# EAGLE design board (EAGLE 6.4)
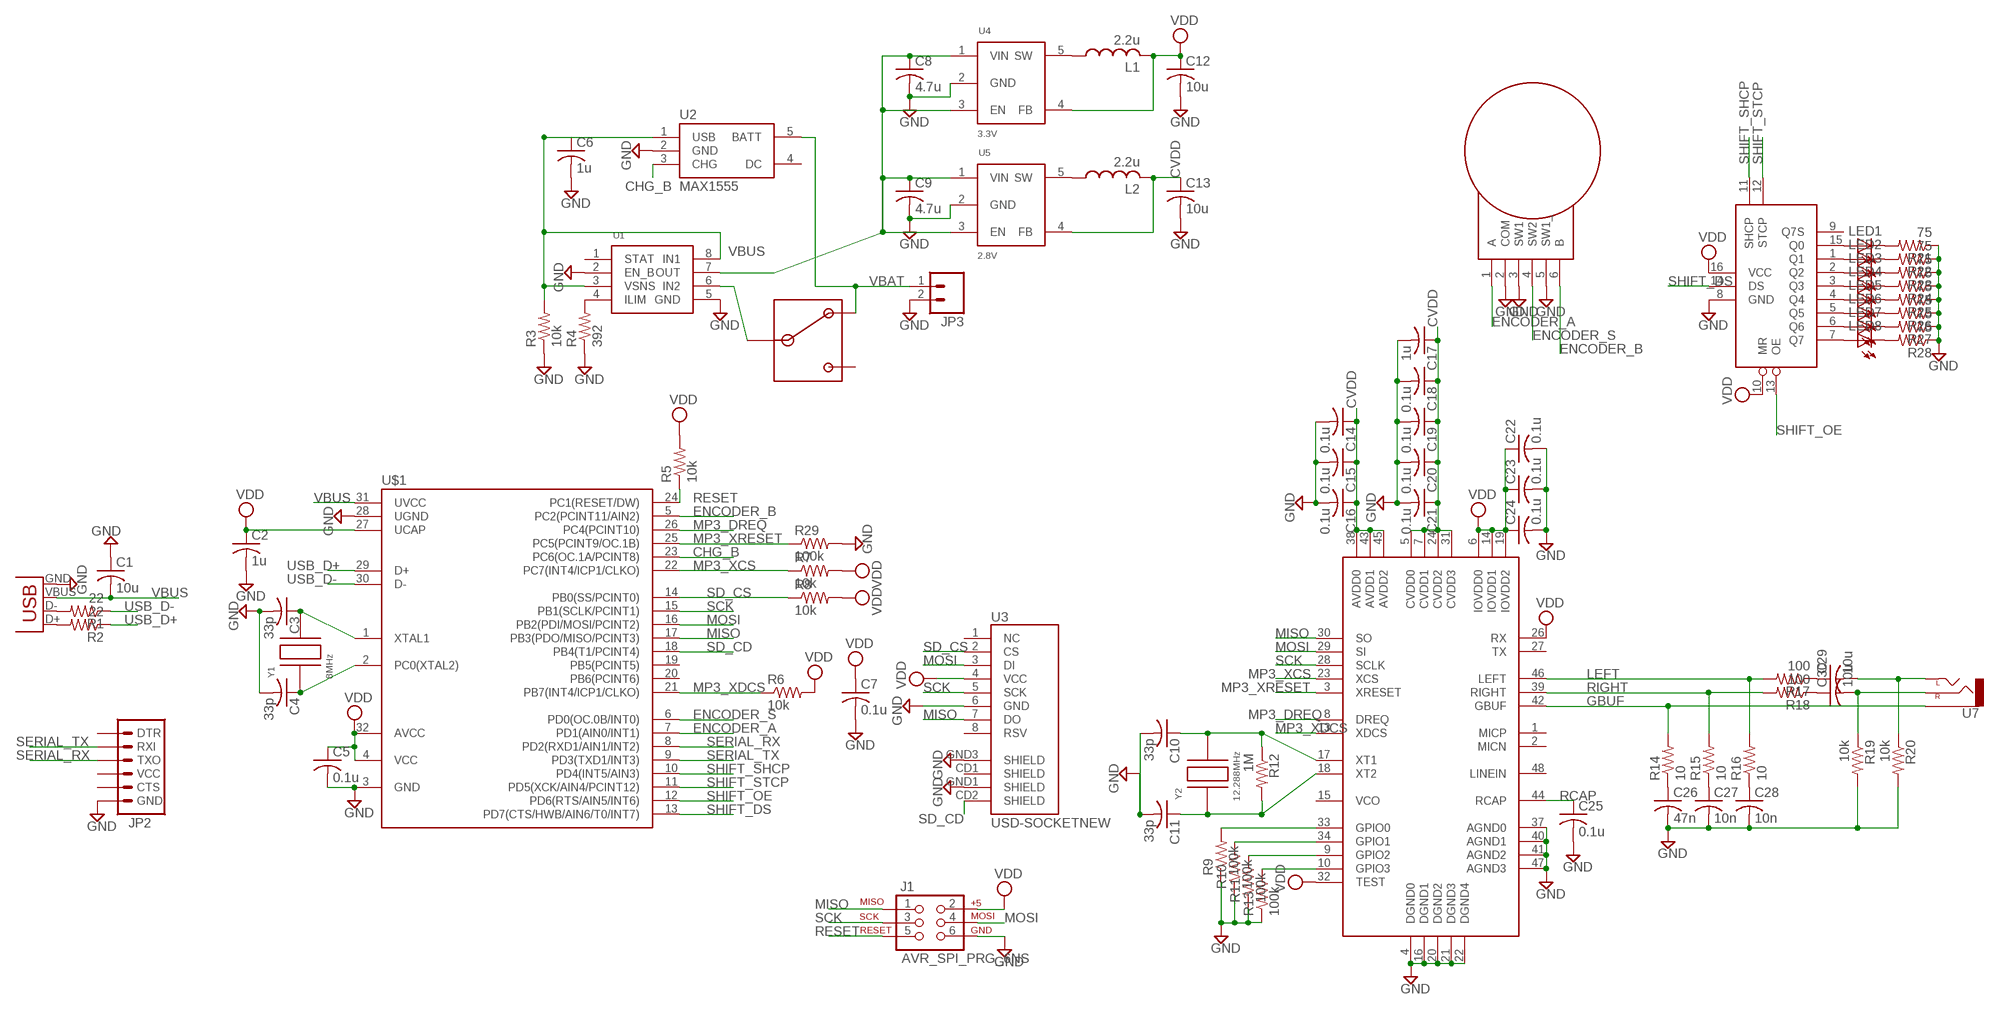
[diagram p0: schematic, sheet 1]

## Parts
C1  10u  C-USC0603K  [C0603K]
C2  1u  C-USC0603K  [C0603K]
C3  33p  C-USC0603K  [C0603K]
C4  33p  C-USC0603K  [C0603K]
C5  0.1u  C-USC0603K  [C0603K]
C6  1u  C-USC0603K  [C0603K]
C7  0.1u  C-USC0603K  [C0603K]
C8  4.7u  C-USC0603K  [C0603K]
C9  4.7u  C-USC0603K  [C0603K]
C10  33p  C-USC0603K  [C0603K]
C11  33p  C-USC0603K  [C0603K]
C12  10u  C-USC0603K  [C0603K]
C13  10u  C-USC0603K  [C0603K]
C14  0.1u  C-USC0603K  [C0603K]
C15  0.1u  C-USC0603K  [C0603K]
C16  0.1u  C-USC0603K  [C0603K]
C17  1u  C-USC0603K  [C0603K]
C18  0.1u  C-USC0603K  [C0603K]
C19  0.1u  C-USC0603K  [C0603K]
C20  0.1u  C-USC0603K  [C0603K]
C21  0.1u  C-USC0603K  [C0603K]
C22  0.1u  C-USC0603K  [C0603K]
C23  0.1u  C-USC0603K  [C0603K]
C24  0.1u  C-USC0603K  [C0603K]
C25  0.1u  C-USC0603K  [C0603K]
C26  47n  C-USC0603K  [C0603K]
C27  10n  C-USC0603K  [C0603K]
C28  10n  C-USC0603K  [C0603K]
C29  10u  C-USC0603K  [C0603K]
C30  10u  C-USC0603K  [C0603K]
J1  AVR_SPI_PRG_6NS  [2X3-NS]
JP1  USBSMD  [USB-MINIB]
JP2  ARDUINO_SERIAL_PROGRAMLOCK  [1X06_LOCK]
JP3  M02PTH  [1X02]
L1  2.2u  IHLP-2020CZ-11  [IHLP-2020CZ-11]
L2  2.2u  IHLP-2020CZ-11  [IHLP-2020CZ-11]
LED1  LED1206  [LED-1206]
LED2  LED1206  [LED-1206]
LED3  LED1206  [LED-1206]
LED4  LED1206  [LED-1206]
LED5  LED1206  [LED-1206]
LED6  LED1206  [LED-1206]
LED7  LED1206  [LED-1206]
LED8  LED1206  [LED-1206]
R1  22  R-US_R0603W  [R0603W]
R2  22  R-US_R0603W  [R0603W]
R3  10k  R-US_R0603  [R0603]
R4  392  R-US_R0603  [R0603]
R5  10k  R-US_R0603  [R0603]
R6  10k  R-US_R0603W  [R0603W]
R7  10k  R-US_R0603W  [R0603W]
R8  10k  R-US_R0603W  [R0603W]
R9  100k  R-US_R0603W  [R0603W]
R10  100k  R-US_R0603W  [R0603W]
R11  100k  R-US_R0603W  [R0603W]
R12  1M  R-US_R0603  [R0603]
R13  100k  R-US_R0603W  [R0603W]
R14  10  R-US_R0603W  [R0603W]
R15  10  R-US_R0603W  [R0603W]
R16  10  R-US_R0603W  [R0603W]
R17  100  R-US_R0603W  [R0603W]
R18  100  R-US_R0603W  [R0603W]
R19  10k  R-US_R0603W  [R0603W]
R20  10k  R-US_R0603W  [R0603W]
R21  75  R-US_R0603W  [R0603W]
R22  75  R-US_R0603W  [R0603W]
R23  75  R-US_R0603W  [R0603W]
R24  75  R-US_R0603W  [R0603W]
R25  75  R-US_R0603W  [R0603W]
R26  75  R-US_R0603W  [R0603W]
R27  75  R-US_R0603W  [R0603W]
R28  75  R-US_R0603W  [R0603W]
R29  100k  R-US_R0603W  [R0603W]
S1  JS102011SAQN  [JS102011SAQN]
S2  EVQ-WKA  [EVQ-WKA]
U1  TPS2112A  [TSSOP8]
U2  MAX1555  [SOT23-5]
U3  USD-SOCKETNEW  [MICRO-SD-SOCKET-PP]
U4  3.3V  LM3671  [SOT23-5]
U5  2.8V  LM3671  [SOT23-5]
U6  74HC595  [TSSOP16]
U7  AUDIO-JACKSMD2  [AUDIO-JACK-3.5MM-SMD]
U$1  ATMEGA32U2  [TQFP32-08]
U$2  VS1003  [LQFP-48]
Y1  8MHz  CSM-7X  [HC49/US]
Y2  12.288MHz  CSM-3X  [CSM-3X]

## Nets
CHG_B: U2.3(CHG) U$1.23(PC6(OC.1A/PCINT8))
CVDD: C13.1 C14.1 C15.1 C16.1 C17.1 C18.1 C19.1 C20.1 C21.1 L2.P$2 U5.4(FB) U$2.5(CVDD0) U$2.7(CVDD1) U$2.24(CVDD2) U$2.31(CVDD3) U$2.38(AVDD0) U$2.43(AVDD1) U$2.45(AVDD2)
ENCODER_A: S2.1(A) U$1.7(PD1(AIN0/INT1))
ENCODER_B: S2.6(B) U$1.5(PC2(PCINT11/AIN2))
ENCODER_S: S2.4(SW2) U$1.6(PD0(OC.0B/INT0))
GBUF: R14.2 U7.SLEEVE U$2.42(GBUF)
GND: C1.1 C2.2 C3.2 C4.2 C5.2 C6.2 C7.2 C8.2 C9.2 C10.2 C11.2 C12.2 C13.2 C14.2 C15.2 C16.2 C17.2 C18.2 C19.2 C20.2 C21.2 C22.2 C23.2 C24.2 C25.2 C26.2 C27.2 C28.2 J1.6 JP1.GND JP2.6(GND) JP3.2 R3.1 R4.1 R9.1 R10.1 R11.1 R13.1 R19.2 R20.2 R21.1 R22.1 R23.1 R24.1 R25.1 R26.1 R27.1 R28.1 R29.2 S2.2(COM) S2.3(SW1) S2.5(SW1_) U1.2(EN_B) U1.5(GND) U2.2(GND) U3.6(GND) U3.GND1(SHIELD) U3.GND3(SHIELD) U4.2(GND) U5.2(GND) U6.8(GND) U$1.3(GND) U$1.28(UGND) U$2.4(DGND0) U$2.16(DGND1) U$2.20(DGND2) U$2.21(DGND3) U$2.22(DGND4) U$2.37(AGND0) U$2.40(AGND1) U$2.41(AGND2) U$2.47(AGND3)
GPIO0: R9.2 U$2.33(GPIO0)
GPIO1: R10.2 U$2.34(GPIO1)
GPIO2: R11.2 U$2.9(GPIO2)
GPIO3: R13.2 U$2.10(GPIO3)
LEFT: R16.2 R17.2 U$2.46(LEFT)
MISO: J1.1 U3.7(DO) U$1.17(PB3(PDO/MISO/PCINT3)) U$2.30(SO)
MOSI: J1.4 U3.3(DI) U$1.16(PB2(PDI/MOSI/PCINT2)) U$2.29(SI)
MP3_DREQ: U$1.26(PC4(PCINT10)) U$2.8(DREQ)
MP3_XCS: R7.1 U$1.22(PC7(INT4/ICP1/CLKO)) U$2.23(XCS)
MP3_XDCS: R6.1 U$1.21(PB7(INT4/ICP1/CLKO)) U$2.13(XDCS)
MP3_XRESET: R29.1 U$1.25(PC5(PCINT9/OC.1B)) U$2.3(XRESET)
N$1: JP1.D- R1.2
N$2: C3.1 U$1.1(XTAL1) Y1.P$2
N$3: C26.1 R14.1
N$4: C27.1 R15.1
N$5: C28.1 R16.1
N$6: JP1.D+ R2.2
N$7: C11.1 R12.2 U$2.18(XT2) Y2.P$1
N$8: C10.1 R12.1 U$2.17(XT1) Y2.P$2
N$10: C30.1 R18.1
N$11: C29.1 R17.1
N$12: C30.2 R19.1 U7.RING(RIGHT)
N$13: C29.2 R20.1 U7.TIP(LEFT)
N$14: C4.1 U$1.2(PC0(XTAL2)) Y1.P$1
N$17: R4.2 U1.4(ILIM)
N$18: C8.1 C9.1 U1.7(OUT) U4.1(VIN) U4.3(EN) U5.1(VIN) U5.3(EN)
N$19: LED8.A U6.7(Q7)
N$20: LED7.A U6.6(Q6)
N$21: LED6.A U6.5(Q5)
N$22: LED5.A U6.4(Q4)
N$23: LED4.A U6.3(Q3)
N$24: LED3.A U6.2(Q2)
N$25: LED2.A U6.1(Q1)
N$26: LED1.A U6.15(Q0)
N$27: LED1.C R21.2
N$28: LED2.C R22.2
N$29: LED3.C R23.2
N$30: LED4.C R24.2
N$31: LED5.C R25.2
N$32: LED6.C R26.2
N$33: LED7.C R27.2
N$34: LED8.C R28.2
N$35: L1.P$1 U4.5(SW)
N$36: L2.P$1 U5.5(SW)
N$37: S1.P$2 U1.6(IN2)
RCAP: C25.1 U$2.44(RCAP)
RESET: J1.5 R5.1 U$1.24(PC1(RESET/DW))
RIGHT: R15.2 R18.2 U$2.39(RIGHT)
SCK: J1.3 U3.5(SCK) U$1.15(PB1(SCLK/PCINT1)) U$2.28(SCLK)
SD_CD: U3.CD2(SHIELD) U$1.18(PB4(T1/PCINT4))
SD_CS: R8.1 U3.2(CS) U$1.14(PB0(SS/PCINT0))
SERIAL_RX: JP2.3(TXO) U$1.8(PD2(RXD1/AIN1/INT2))
SERIAL_TX: JP2.2(RXI) U$1.9(PD3(TXD1/INT3))
SHIFT_DS: U6.14(DS) U$1.13(PD7(CTS/HWB/AIN6/T0/INT7))
SHIFT_OE: U6.13(OE) U$1.12(PD6(RTS/AIN5/INT6))
SHIFT_SHCP: U6.11(SHCP) U$1.10(PD4(INT5/AIN3))
SHIFT_STCP: U6.12(STCP) U$1.11(PD5(XCK/AIN4/PCINT12))
USB_D+: R2.1 U$1.29(D+)
USB_D-: R1.1 U$1.30(D-)
VBAT: JP3.1 S1.P$3 U2.5(BATT)
VBUS: C1.2 C6.1 JP1.VBUS R3.2 U1.3(VSNS) U1.8(IN1) U2.1(USB) U$1.31(UVCC)
VDD: C2.1 C5.1 C7.1 C12.1 C22.1 C23.1 C24.1 J1.2 L1.P$2 R5.2 R6.2 R7.2 R8.2 U3.4(VCC) U4.4(FB) U6.10(MR) U6.16(VCC) U$1.4(VCC) U$1.27(UCAP) U$1.32(AVCC) U$2.6(IOVDD0) U$2.14(IOVDD1) U$2.19(IOVDD2) U$2.26(RX) U$2.32(TEST)
Unconnected: JP2.1(DTR) JP2.4(VCC) JP2.5(CTS) S1.P$1 U1.1(STAT) U2.4(DC) U3.1(NC) U3.8(RSV) U3.CD1(SHIELD) U6.9(Q7S) U$1.19(PB5(PCINT5)) U$1.20(PB6(PCINT6)) U$2.1(MICP) U$2.2(MICN) U$2.15(VCO) U$2.27(TX) U$2.48(LINEIN)

## Library data of the parts
C1-C30 = rcl:C-US: CAPACITOR, American symbol
J1 = SparkFun-Connectors:AVR_SPI_PRG_6: AVR ISP 6 Pin This is the reduced ISP connector for AVR programming. Common on Arduino. This footprint will take up less PCB space and can be used with a 10-pin to 6-pin adapter such as SKU: BOB-08508
JP1 = SparkFun-Connectors:USB: USB Connectors USB-B-PTH is fully proven SKU : PRT-00139/CONN-08278 USB-miniB is fully proven SKU : PRT-00587 USB-A-PCB is untested. USB-A-H is throughly reviewed, but untested. Spark Fun Electronics SKU : PRT-00437 USB-B-SMT is throughly reviewed, but untested. Needs silkscreen touching up. USB-A-S has not been used/tested USB-MB-H has not been used/tested USB-MICROB has been used. CONN-09505
JP2 = SparkFun-Connectors:ARDUINO_SERIAL_PROGRAM: FTDI connector footprints
JP3 = SparkFun-Connectors:M02: Header 2 Standard 2-pin 0.1" header. Use with straight break away headers (SKU : PRT-00116), right angle break away headers (PRT-00553), swiss pins (PRT-00743), machine pins (PRT-00117), and female headers (PRT-00115). Molex polarized connector foot print use with SKU : PRT-08233 with associated crimp pins and housings.
L1 L2 = mkmp3:IHLP-2020CZ-11: IHLP-2020CZ-11 - SMT Inductor Digikey: 541-1236-1-ND
LED1-LED8 = LilyPad-Wearables:LED: LEDs Standard schematic elements and footprints for 5mm, 3mm, 1206, and 0603 sized LEDs. 5mm - Spark Fun Electronics SKU : Comp-SBL
R1-R29 = rcl:R-US_: RESISTOR, American symbol
S1 = mkmp3:JS102011SAQN: JS102011SAQN - SMT slide switch Digikey: 401-1999-1-ND
S2 = mkmp3:EVQ-WKA: EVQ-WKA - Rotary encoder & switch Digikey: P13381SCT-ND
U1 = mkmp3:TPS2112A: TPS2112A - Source selector switch Digikey: 296-34595-5-ND
U2 = SparkFun-PowerIC:MAX1555: MAX1555 Lithium Charger IC SOT-23 Lithium Polymer charging IC. Schematic element and footprint proven. Spark Fun Electronics SKU : COM-00674
U3 = SparkFun-Connectors:USD-SOCKET: microSD Socket Push-push type uSD socket. Schematic element and footprint production proven. Spark Fun Electronics SKU : PRT-00127. tDoc lines correctly indicate media card edge positions when inserting (unlocked, locked, depressed).
U4 U5 = mkmp3:LM3671: LM3671 - Buck regulator Texas Instruments Step-down (buck) power regulator
U6 = mkmp3:74HC595: 74HC595 - 8-bit shift register Digikey: 568-2263-1-ND
U7 = mkmp3:AUDIO-JACK: 3.5mm Audio Jack Simple 3.5mm common PCB mount audio jack. SKU: PRT-08032
U$1 = CEDT:ATMEGA32U2
U$2 = mkmp3:VS1003
Y1 = mkmp3:CSM-7X: CSM-7X - Quartz Crystal ECS International SMD version of the HC-49USX leaded crystal
Y2 = mkmp3:CSM-3X: CMS-3X - Quartz Crystal ECS International Miniature low profile SMD quartz crystal

## Board
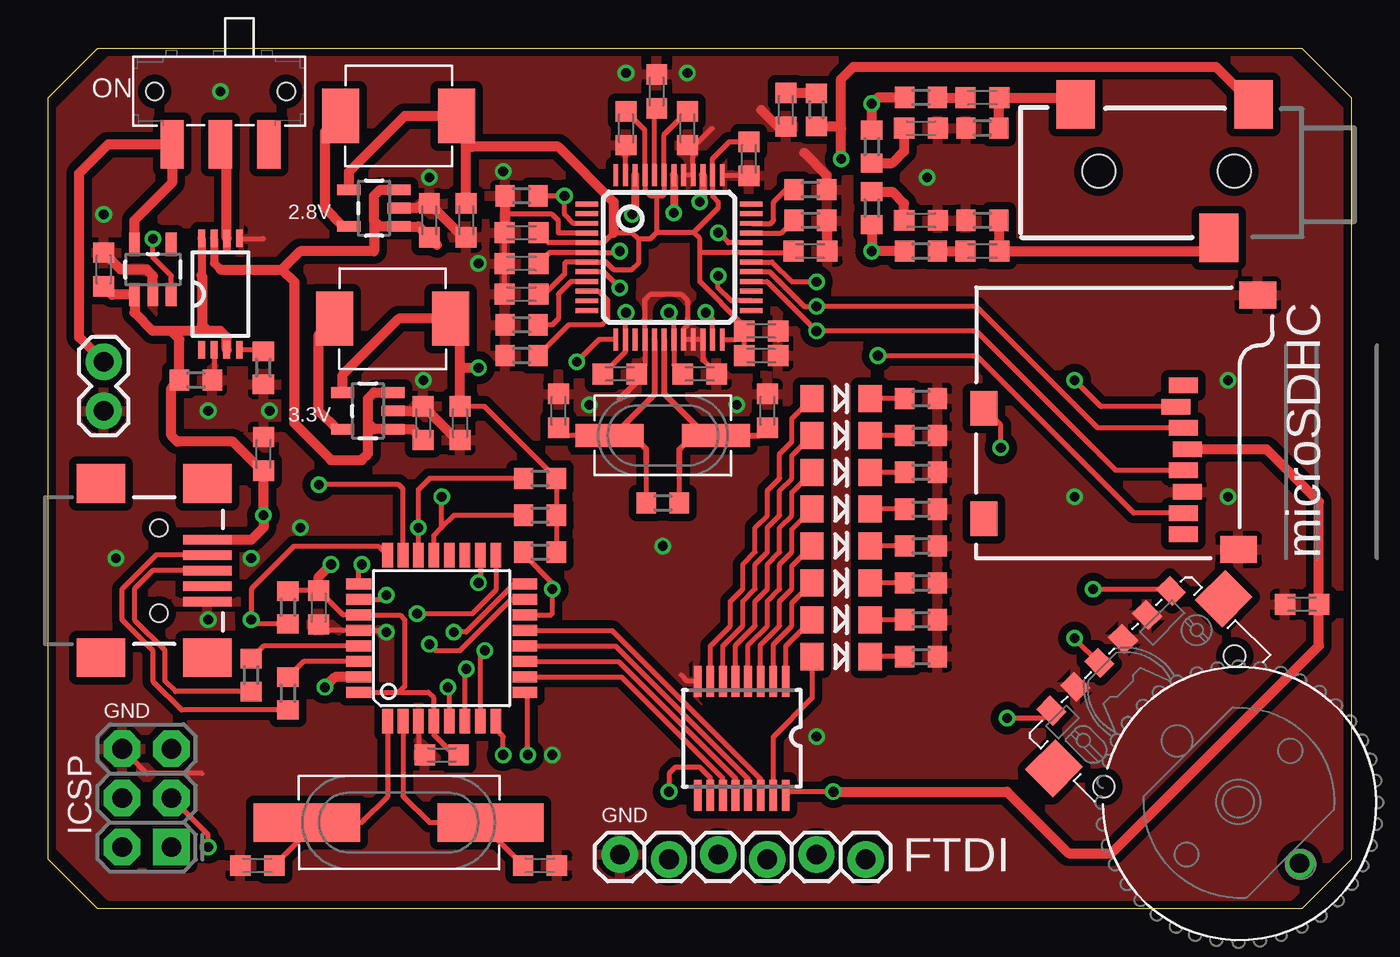
[diagram p1: board, top side]
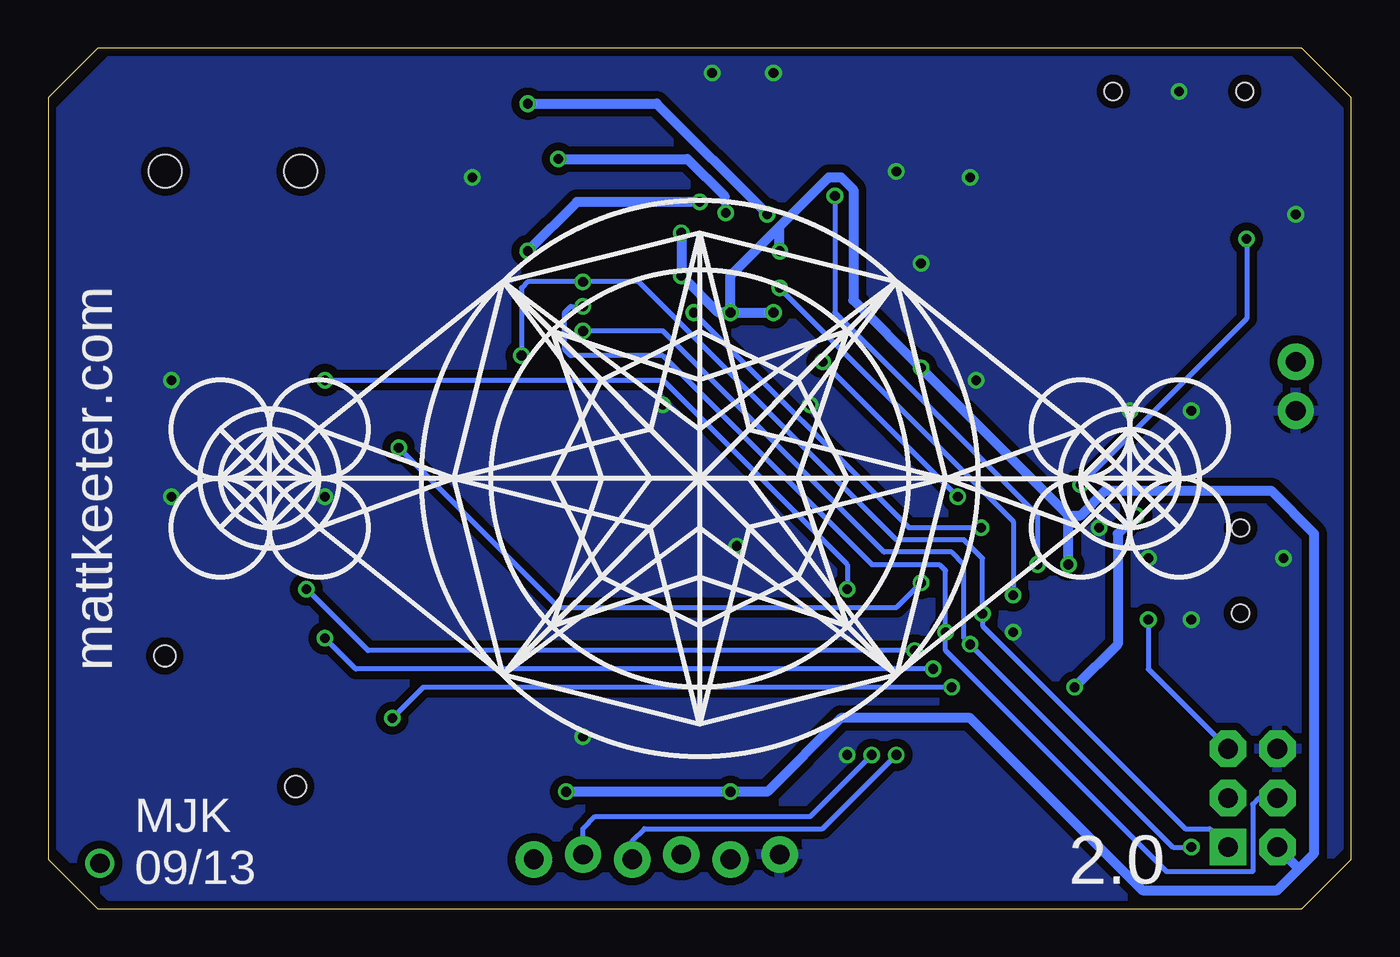
[diagram p2: board, bottom side, seen from below]

Size 67.31 x 44.45 mm. Coordinates in mm from the lower left corner, seen from the top.
Outline: 0,2.54 0,41.91 2.54,44.45 64.77,44.45 67.31,41.91 67.31,2.54 64.77,0 2.54,0 0,2.54
Copper layers (1*16): Top 0.0356mm / dielectric 1.5011mm / Bottom 0.0356mm
Design rules "OSHpark *": minimum track width 6mil, minimum drill 13mil, track to track 6mil, track to pad 6mil, pad to pad 6mil, via to via 6mil, smd to smd 6mil, copper to edge 15mil, drill to drill 6mil, minimum pad ring 7mil, minimum via ring 7mil, stop-mask expansion 4mil, vias tented up to drill 20mil, thermal gap 10mil

### Footprints (pad centres in the part's own frame; a part is rotated, then mirrored left to right if it is on the bottom)
C0603K = smd 1.05 x 1.08: 1 -0.875,0; 2 0.875,0
2X3-NS = drill 1.016 pad 1.88 square: 1 -2.54,-1.27 | drill 1.016 pad 1.88 octagon: 2 -2.54,1.27; 3 0,-1.27; 4 0,1.27; 5 2.54,-1.27; 6 2.54,1.27
USB-MINIB = smd 2.5 x 0.5: D+ 2.5,0; D- 2.5,0.8; GND 2.5,-1.6; ID 2.5,-0.8; VBUS 2.5,1.6 | smd 2.5 x 2: MTN1 -3,4.5; MTN2 2.5,4.5; MTN3 -3,-4.5; MTN4 2.5,-4.5 | hole 0.9: 0,2.2; 0,-2.2
1X06_LOCK = drill 1.016 pad 1.88: 1 0,0; 2 2.54,-0.254; 3 5.08,0; 4 7.62,-0.254; 5 10.16,0; 6 12.7,-0.254
1X02 = drill 1.016 pad 1.88: 1 0,0; 2 2.54,0
IHLP-2020CZ-11 = smd 1.905 x 2.794: P$1 -2.997,0; P$2 2.997,0
LED-1206 = smd 1.2 x 1.4: A -1.5,0; C 1.5,0
R0603W = smd 1 x 1.1: 1 -0.85,0; 2 0.85,0
R0603 = smd 1 x 1.1: 1 -0.85,0; 2 0.85,0
JS102011SAQN = smd 1.2 x 2.5: P$1 -2.5,2.75; P$2 0,2.75; P$3 2.5,2.75 | hole 0.9: -3.4,0; 3.4,0
EVQ-WKA = smd 1 x 1.2: 1 -5.25,0; 2 -3.5,0; 3 -1.75,0; 4 0,0; 5 1.75,0; 6 3.5,0 | smd 2.2 x 2: NC1 -6.9,2.2; NC2 5.5,2.2 | drill 1: P$1 0,14.65 | hole 1.1: 4.35,4.7; -5.2,4.7
TSSOP8 = smd 0.9 x 0.35: 1 -2.875,0.975; 2 -2.875,0.325; 3 -2.875,-0.325; 4 -2.875,-0.975; 5 2.875,-0.975; 6 2.875,-0.325; 7 2.875,0.325; 8 2.875,0.975
SOT23-5 = smd 0.55 x 1.2: 1 -0.95,-1.3; 2 0,-1.3; 3 0.95,-1.3; 4 0.95,1.3; 5 -0.95,1.3
MICRO-SD-SOCKET-PP = smd 0.8 x 1.5: 1 -8.94,10.7; 2 -7.84,10.3; 3 -6.74,10.7; 4 -5.64,10.9; 5 -4.54,10.7; 6 -3.44,10.9; 7 -2.34,10.7; 8 -1.24,10.7 | smd 1.8 x 1.4: CD1 -2.05,0.4; CD2 -7.75,0.4 | smd 1.4 x 1.9: GND1 -13.6,14.55; GND3 -0.45,13.55
TSSOP16 = smd 0.4 x 1.6: 1 -2.225,-2.85; 2 -1.575,-2.85; 3 -0.925,-2.85; 4 -0.275,-2.85; 5 0.375,-2.85; 6 1.025,-2.85; 7 1.675,-2.85; 8 2.325,-2.85; 9 2.325,3.05; 10 1.675,3.05; 11 1.025,3.05; 12 0.375,3.05; 13 -0.275,3.05; 14 -0.925,3.05; 15 -1.575,3.05; 16 -2.225,3.05
AUDIO-JACK-3.5MM-SMD = smd 2 x 2.5: RING 4.3,3.45; SLEEVE 2.5,-3.45; TIP 11.7,-3.45 | hole 1.702: 3.5,0; 10.5,0
TQFP32-08 = smd 1.27 x 0.559: 1 -4.293,2.8; 2 -4.293,2; 3 -4.293,1.2; 4 -4.293,0.4; 5 -4.293,-0.4; 6 -4.293,-1.2; 7 -4.293,-2; 8 -4.293,-2.8; 17 4.293,-2.8; 18 4.293,-2; 19 4.293,-1.2; 20 4.293,-0.4; 21 4.293,0.4; 22 4.293,1.2; 23 4.293,2; 24 4.293,2.8 | smd 0.559 x 1.27: 9 -2.8,-4.293; 10 -2,-4.293; 11 -1.2,-4.293; 12 -0.4,-4.293; 13 0.4,-4.293; 14 1.2,-4.293; 15 2,-4.293; 16 2.8,-4.293; 25 2.8,4.293; 26 2,4.293; 27 1.2,4.293; 28 0.4,4.293; 29 -0.4,4.293; 30 -1.2,4.293; 31 -2,4.293; 32 -2.8,4.293
LQFP-48 = smd 0.254 x 1.143: 1 -2.75,-4.25; 2 -2.25,-4.25; 3 -1.75,-4.25; 4 -1.25,-4.25; 5 -0.75,-4.25; 6 -0.25,-4.25; 7 0.25,-4.25; 8 0.75,-4.25; 9 1.25,-4.25; 10 1.75,-4.25; 11 2.25,-4.25; 12 2.75,-4.25; 25 2.75,4.25; 26 2.25,4.25; 27 1.75,4.25; 28 1.25,4.25; 29 0.75,4.25; 30 0.25,4.25; 31 -0.25,4.25; 32 -0.75,4.25; 33 -1.25,4.25; 34 -1.75,4.25; 35 -2.25,4.25; 36 -2.75,4.25 | smd 1.143 x 0.254: 13 4.25,-2.75; 14 4.25,-2.25; 15 4.25,-1.75; 16 4.25,-1.25; 17 4.25,-0.75; 18 4.25,-0.25; 19 4.25,0.25; 20 4.25,0.75; 21 4.25,1.25; 22 4.25,1.75; 23 4.25,2.25; 24 4.25,2.75; 37 -4.25,2.75; 38 -4.25,2.25; 39 -4.25,1.75; 40 -4.25,1.25; 41 -4.25,0.75; 42 -4.25,0.25; 43 -4.25,-0.25; 44 -4.25,-0.75; 45 -4.25,-1.25; 46 -4.25,-1.75; 47 -4.25,-2.25; 48 -4.25,-2.75
HC49/US = smd 5.5 x 2: P$1 -4.75,0; P$2 4.75,0
CSM-3X = smd 3.5 x 1.2: P$1 -2.75,0; P$2 2.75,0

### Placement (x,y rotation side)
C1  11.11,23.5 270 top
C2  13.97,15.56 270 top
C3  10.79,2.22 180 top
C4  25.4,2.22 0 top
C5  20.32,7.94 180 top
C6  2.86,33.02 90 top
C7  64.77,15.72 180 top
C8  19.37,25.08 90 top
C9  19.69,35.56 90 top
C10  26.35,25.72 90 top
C11  37.15,25.72 90 top
C12  21.27,25.08 270 top
C13  21.59,35.56 270 top
C14  36.2,38.73 270 top
C15  33.02,40.32 270 top
C16  24.45,31.75 180 top
C17  36.83,28.58 0 top
C18  39.37,33.97 0 top
C19  24.45,34.92 180 top
C20  36.83,29.85 0 top
C21  29.85,40.32 270 top
C22  24.45,33.34 180 top
C23  29.53,27.62 0 top
C24  33.66,27.62 0 top
C25  31.43,42.23 90 top
C26  38.1,41.27 270 top
C27  45.09,35.56 0 top
C28  45.09,40.32 0 top
C29  48.26,41.91 0 top
C30  48.26,33.97 0 top
J1  5.08,5.71 90 top
JP1  5.71,17.46 0 top
JP2  42.23,2.54 180 top
JP3  2.86,28.26 270 top
L1  17.78,30.48 0 top
L2  18.1,40.96 0 top
LED1  40.96,13.02 0 top
LED2  40.96,14.92 0 top
LED3  40.96,16.83 0 top
LED4  40.96,18.73 0 top
LED5  40.96,20.64 0 top
LED6  40.96,22.54 0 top
LED7  40.96,24.45 0 top
LED8  40.96,26.35 0 top
R1  12.38,11.11 270 top
R2  10.48,12.06 270 top
R3  7.62,27.31 180 top
R4  11.11,27.94 90 top
R5  12.38,15.56 90 top
R6  25.4,20.32 0 top
R7  25.4,22.23 0 top
R8  25.4,18.42 0 top
R9  39.37,35.56 180 top
R10  39.37,37.15 180 top
R11  24.45,30.16 0 top
R12  31.75,20.96 0 top
R13  24.45,28.58 0 top
R14  39.69,41.27 270 top
R15  42.54,36.2 270 top
R16  42.54,39.37 90 top
R17  45.09,41.91 180 top
R18  45.09,33.97 180 top
R19  48.26,35.56 180 top
R20  48.26,40.32 180 top
R21  45.09,13.02 180 top
R22  45.09,14.92 180 top
R23  45.09,16.83 180 top
R24  45.09,18.73 180 top
R25  45.09,20.64 180 top
R26  45.09,22.54 180 top
R27  45.09,24.45 180 top
R28  45.09,26.35 180 top
R29  24.45,36.83 180 top
S1  8.89,42.23 180 top
S2  54.29,12.7 225 top
U1  8.89,31.75 90 top
U2  5.4,33.02 0 top
U3  47.94,18.1 270 top
U4  16.51,25.72 90 top
U5  16.83,36.2 90 top
U6  35.88,8.89 180 top
U7  64.77,38.1 180 top
U$1  20.32,13.97 90 top
U$2  32.07,33.66 270 top
Y1  18.1,4.45 180 top
Y2  31.75,24.45 180 top

### Tracks (layer width: path | path; a pad name or v marks a point on that pad's centre or on a via)
CHG_B  (via drill 0.5)
  Top 0.254: v5.4,34.61 5.4,33.66 6.35,32.7 U2.3 | U$1.23 18.32,21.69 18.1,21.91 v13.97,21.91
  Bottom 0.254: v5.4,34.61 5.4,30.48 v13.97,21.91
CVDD
  Top 0.254: C14.1 35.16,39.61 34.32,38.76 U$2.38 34.32,36.8 34.61,36.51 34.61,36.2 33.34,34.92 | C15.1 31.82,39.99 U$2.43 31.82,36.9 31.75,36.83 31.43,36.83 | C21.1 30.82,40.23 U$2.45 30.82,37.13 31.12,36.83 31.43,36.83 | U$2.24 35.52,29.41 C20.1 | C20.1 35.88,29.85 35.88,30.16 33.66,32.38 33.66,33.97 | 30.48,34.61 30.16,34.92 29.21,34.92 28.69,34.41 U$2.5 25.84,34.41 C19.1 | 30.48,34.61 30.48,33.34 30.16,33.02 29.21,33.02 28.83,33.41 U$2.7 26.74,33.41 26.67,33.34 26.67,32.78 25.64,31.75 C16.1 | 30.48,34.61 31.12,34.61 31.43,34.92 | 31.43,36.83 31.43,34.92 | C17.1 C20.1 | C18.1 38.43,33.91 U$2.31 33.72,33.91 33.66,33.97 | 33.34,34.92 31.43,34.92 | 33.66,33.97 33.66,34.61 33.34,34.92
  Top 0.508: U5.4 15.53,38.07 18.42,40.96 L2.P$2 21.59,40.46 21.59,39.69 | 29.21,34.92 29.21,36.51 26.35,39.37 21.91,39.37 21.59,39.69 | C13.1 21.59,39.69
ENCODER_A  (via drill 0.5)
  Top 0.254: U$1.7 22.32,13.11 v22.54,13.33 | v53.98,16.51 57.91,16.51 S2.1
  Bottom 0.254: v53.98,16.51 50.8,13.33 v22.54,13.33
ENCODER_B  (via drill 0.5)
  Top 0.254: U$1.5 20.72,11.35 v20.64,11.43 | v49.53,9.84 51.43,9.84 S2.6
  Bottom 0.254: v20.64,11.43 47.94,11.43 v49.53,9.84
ENCODER_S  (via drill 0.5)
  Top 0.254: U$1.6 21.52,12.31 v21.59,12.38 | v53.02,13.97 S2.4
  Bottom 0.254: v21.59,12.38 51.43,12.38 v53.02,13.97
GBUF  (via drill 0.5)
  Top 0.406: U$2.42 v32.32,35.95
  Top 0.508: U7.SLEEVE 60.32,43.5 41.59,43.5 40.96,42.86 40.96,40.32 | v40.96,38.73 40.96,40.32 | R14.2 40.85,40.42 40.96,40.32
  Bottom 0.406: v32.32,35.95 32.32,36.76 32.38,36.83
  Bottom 0.508: v40.96,38.73 34.29,38.73 32.38,36.83
GND  (via drill 0.5)
  Top 0.254: U1.2 8.56,27.4 R3.1 | C2.2 14.28,14.37 U$1.28 17.38,14.37 v17.46,14.29 | U$1.3 19.12,8.26 C5.2 | C16.2 C22.2 C19.2 | U$2.37 36.15,37.91 C14.2 | U$2.41 U$2.40 33.32,39.15 | U$2.47 29.82,39.42 C21.2 | C20.2 37.7,29.37 | 34.29,40.32 33.32,39.35 33.32,39.15 | U$2.4 26.37,34.91 26.35,34.92 26.35,35.56 26.04,35.88 23.6,35.88 | 30.82,28.04 U$2.16 30.82,31.45 31.12,31.75 32.7,31.75 33.02,31.43 33.02,30.16 32.82,29.96 U$2.20 U$2.21 U$2.22 33.82,28.34 C24.2 | 33.32,39.15 C15.2 | U1.5 11.1,34.62 11.11,34.61 | U6.8 33.03,11.74 32.7,12.06 | J1.6 5.08,6.98 7.94,6.98
  Top 0.305: C23.2 30.4,27.23 29.53,26.35
  Top 0.406: C9.2 19.29,36.43 19.05,36.2
  Top 0.508: 19.05,36.2 18.1,36.2 | U4.2 19.13,25.72 C8.2 21.12,24.21 C12.2 | 19.69,36.27 C9.2 21.44,34.68 C13.2 | U2.2 5.4,32.7 5.08,33.02 3.73,33.02 C6.2 | R9.1 40.22,34 C18.2 | R10.1 40.22,37.88 39.05,39.05 | 38.1,40.32 37.78,40.32 36.83,41.27 | R29.2 23.6,35.88 23.6,34.95 C19.2
  other vias: 39.69,8.89 45.4,37.78 13.02,19.69 11.43,25.72 19.37,27.31 19.69,37.78 8.26,14.92 60.96,21.27 26.04,7.94 2.86,35.88 29.85,43.18 8.26,25.72 60.96,27.31 35.56,26.04 10.48,18.1 3.49,18.1 8.89,42.23 27.94,26.04 31.75,18.73 53.02,21.27 33.02,43.18 22.23,33.34 23.5,38.1
  pour Bottom (isolate 0.406): 3.17,0.64 0.64,3.17 0.64,41.27 3.17,43.81 64.14,43.81 66.68,41.27 66.68,3.17 64.14,0.64
  pour Top (isolate 0.406): 3.17,0.64 0.64,3.17 0.64,41.27 3.17,43.81 64.14,43.81 66.68,41.27 66.68,3.17 64.14,0.64
GPIO0
  Top 0.254: U$2.33 37.86,34.91 R9.2
GPIO1
  Top 0.254: U$2.34 37.31,35.41 37.46,35.56 37.46,36.51 38.1,37.15 R10.2
GPIO2
  Top 0.254: U$2.9 27.01,32.41 26.35,31.75 26.35,30.48 26.04,30.16 R11.2
GPIO3
  Top 0.254: U$2.10 28.42,31.91 28.89,31.43 28.89,30.48 28.58,30.16 26.89,30.16 R13.2
LEFT  (via drill 0.5)
  Top 0.406: U$2.46 30.32,36.03 v30.16,35.88
  Top 0.508: R16.2 v42.54,41.59 42.86,41.91 R17.2
  Bottom 0.508: v30.16,35.88 35.88,41.59 v42.54,41.59
MISO  (via drill 0.5)
  Top 0.254: U$1.17 23.12,16.45 21.91,15.24 v19.05,15.24 | U$2.30 37.4,33.41 38.42,32.38 v39.69,32.38 | v42.86,28.58 47.94,28.58 56.08,20.44 U3.7
  Bottom 0.254: v42.86,28.58 42.86,32.07 42.54,32.38 v39.69,32.38 36.83,32.38 23.5,19.05 20,19.05 19.05,18.1 v19.05,15.24 19.05,14.61 8.57,4.13 7.3,4.13 J1.1
MOSI  (via drill 0.5)
  Top 0.254: U$2.29 37.26,32.91 39.05,31.12 v39.69,31.12 47.94,31.12 54.22,24.84 U3.3 | U$1.16 24.07,16.77 21.59,14.29 v20.96,14.29
  Bottom 0.254: v39.69,31.12 40.32,31.12 40.64,30.8 40.64,28.89 40.32,28.58 35.56,28.58 24.77,17.78 21.27,17.78 20.96,17.46 v20.96,14.29 20.96,13.33 9.53,1.91 5.08,1.91 5.08,5.4 4.76,5.71 J1.4
MP3_DREQ  (via drill 0.5)
  Top 0.254: U$2.8 28.69,32.91 v29.53,32.07 | U$1.26 17.24,15.97 v17.46,16.19
  Bottom 0.254: v17.46,16.19 17.46,20 v29.53,32.07
MP3_XCS  (via drill 0.5)
  Top 0.254: U$2.23 34.32,30.45 v33.97,30.8 | U$1.22 v19.12,19.69 19.12,21.66 19.69,22.23 R7.1
  Bottom 0.254: v33.97,30.8 22.86,19.69 v19.12,19.69
MP3_XDCS  (via drill 0.5)
  Top 0.254: U$2.13 28.45,29.41 v27.31,28.26 | U$1.21 19.92,19.29 20.32,19.69 | 20.32,19.69 v20.32,21.27 | R6.1 20.96,20.32 20.32,19.69
  Bottom 0.254: v27.31,28.26 v20.32,21.27
MP3_XRESET  (via drill 0.5)
  Top 0.254: U$2.3 27.14,35.41 26.67,35.88 v26.67,36.83 R29.1 | U$1.25 16.03,17.62 v16.19,17.78
  Bottom 0.254: v16.19,17.78 16.19,20.32 26.67,30.8 v26.67,36.83
N$1
  Top 0.254: JP1.D- 5.56,18.26 3.81,16.51 3.81,14.92 5.4,13.33 5.4,11.75 6.88,10.26 R1.2
N$2
  Top 0.254: U$1.1 17.52,5.77 16.19,4.45 Y1.P$2 13.35,3.9 C3.1
N$3
  Top 0.508: R14.1 38.12,42.12 C26.1
N$4
  Top 0.508: C27.1 44.21,36.43 43.6,37.04 R15.1
N$5
  Top 0.508: C28.1 44.21,39.13 43.6,38.52 R16.1
N$6
  Top 0.254: JP1.D+ 5.4,17.46 4.45,16.51 4.45,14.92 6.03,13.33 6.03,11.75 6.56,11.21 R2.2
N$7
  Top 0.254: R12.2 32.6,22.55 | 36.75,24.45 C11.1
  Top 0.305: U$2.18 31.82,26.6 33.66,24.77 | 33.66,24.77 33.97,24.45 Y2.P$1 36.75,24.45 | 32.6,22.55 32.6,23.71 33.66,24.77
N$8
  Top 0.254: R12.1 30.9,23.08 | Y2.P$2 26.75,24.45 C10.1
  Top 0.305: U$2.17 31.32,26.56 29.69,24.92 | 29.69,24.92 29.53,24.77 29.32,24.77 Y2.P$2 | 30.9,23.08 30.9,23.71 29.69,24.92
N$10
  Top 0.508: R18.1 C30.1
N$11
  Top 0.508: R17.1 C29.1
N$12
  Top 0.254: 49.13,35.59 R19.1
  Top 0.508: R19.1 49.11,34 C30.2 59.79,33.97 U7.RING
N$13
  Top 0.508: R20.1 49.11,41.88 C29.2 52.71,41.91 U7.TIP 52.79,41.27
N$14
  Top 0.254: U$1.2 18.32,5.81 19.69,4.45 Y1.P$1 22.85,3.9 C4.1
N$17
  Top 0.254: U1.4 11.03,28.88 R4.2
N$18
  Top 0.406: U5.3 | U4.3 | 8.89,33.02 8.56,33.34 U1.7
  Top 0.508: 16.83,35.56 17.14,35.24 U5.1 19.12,35.24 C9.1 20.08,34.29 | 16.83,35.56 16.83,36.83 17.15,37.15 U5.3 | C8.1 18.81,24.77 U4.1 16.83,24.77 16.51,25.08 | 16.51,25.08 16.51,26.35 16.83,26.67 U4.3 | 16.83,35.56 16.83,33.97 13.02,33.97 12.06,33.02 | 8.89,33.02 12.06,33.02 | 12.06,33.02 12.7,32.38 12.7,25.08 14.61,23.18 16.19,23.18 16.51,23.5 16.51,25.08
N$19
  Top 0.254: U6.7 34.2,13.56 35.24,14.61 35.24,15.88 35.88,16.51 35.88,17.78 36.51,18.42 36.51,19.69 37.15,20.32 37.15,21.59 37.78,22.23 37.78,23.5 38.42,24.13 38.42,25.31 LED8.A
N$20
  Top 0.254: U6.6 34.85,13.58 35.88,14.61 35.88,15.88 36.51,16.51 36.51,17.78 37.15,18.42 37.15,19.69 37.78,20.32 37.78,21.59 38.42,22.23 38.42,23.41 LED7.A
N$21
  Top 0.254: U6.5 35.5,13.6 36.51,14.61 36.51,15.88 37.15,16.51 37.15,17.78 37.78,18.42 37.78,19.69 38.42,20.32 38.42,21.5 LED6.A
N$22
  Top 0.254: U6.4 36.15,13.61 37.15,14.61 37.15,15.88 37.78,16.51 37.78,17.78 38.42,18.42 38.42,19.6 LED5.A
N$23
  Top 0.254: U6.3 36.8,13.62 37.78,14.61 37.78,15.88 38.42,16.51 38.42,17.69 LED4.A
N$24
  Top 0.254: U6.2 37.45,13.64 38.42,14.61 38.42,15.79 LED3.A
N$25
  Top 0.254: U6.1 38.1,13.57 LED2.A
N$26
  Top 0.254: U6.15 37.45,8.88 39.46,10.88 LED1.A
N$27
  Top 0.254: R21.2 LED1.C
N$28
  Top 0.254: R22.2 LED2.C
N$29
  Top 0.254: R23.2 LED3.C
N$30
  Top 0.254: R24.2 LED4.C
N$31
  Top 0.254: R25.2 LED5.C
N$32
  Top 0.254: R26.2 LED6.C
N$33
  Top 0.254: R27.2 LED7.C
N$34
  Top 0.254: R28.2 LED8.C
N$35
  Top 0.508: U4.5 14.92,24.77 13.97,25.72 13.97,29.67 L1.P$1
N$36
  Top 0.508: U5.5 15.24,35.24 14.29,36.2 14.29,40.14 L2.P$1
N$37
  Top 0.406: U1.6 9.21,34.12
  Top 0.508: U1.6 9.21,39.15 S1.P$2
RCAP
  Top 0.254: U$2.44 31.32,41.24 C25.1
RESET  (via drill 0.5)
  Top 0.254: U$1.24 17.05,18.73 12.7,18.73 10.48,16.51 v10.48,14.92 10.69,14.71 R5.1
  Bottom 0.254: v10.48,14.92 10.48,12.38 J1.5
RIGHT  (via drill 0.5)
  Top 0.406: U$2.39 33.82,36.67 v33.66,36.51
  Top 0.508: R15.2 v42.54,33.97 R18.2
  Bottom 0.508: v33.66,36.51 40,36.51 v42.54,33.97
SCK  (via drill 0.5)
  Top 0.254: U$1.15 23.91,15.97 21.27,13.33 20,13.33 v19.69,13.65 | U$2.28 37.13,32.41 v39.69,29.85 47.94,29.85 55.15,22.64 U3.5 | v8.26,3.17 8.26,3.81 J1.3
  Bottom 0.254: v39.69,29.85 35.56,29.85 24.13,18.42 20.64,18.42 20,17.78 20,13.97 v19.69,13.65 9.21,3.17 v8.26,3.17 8.57,3.17
SD_CD  (via drill 0.5)
  Top 0.254: U$1.18 22.32,16.92 v22.23,16.83 | v49.21,23.81 49.21,24.98 U3.CD2
  Bottom 0.254: v22.23,16.83 23.5,15.56 40.96,15.56 v49.21,23.81
SD_CS  (via drill 0.5)
  Top 0.254: U$1.14 25.96,15.17 26.04,15.24 v26.04,16.51 26.04,16.83 24.55,18.31 R8.1 | U3.2 54.39,25.94 v53.02,27.31
  Bottom 0.254: v53.02,27.31 35.56,27.31 26.04,17.78 v26.04,16.51
SERIAL_RX  (via drill 0.5)
  Top 0.254: v23.5,7.94 23.5,8.89 23.18,9.21 23.18,9.62 U$1.8
  Bottom 0.254: JP2.3 37.15,3.49 36.51,4.13 27.31,4.13 v23.5,7.94
SERIAL_TX  (via drill 0.5)
  Top 0.254: v24.77,7.94 24.77,11.02 U$1.9
  Bottom 0.254: JP2.2 39.69,4.13 39.05,4.76 27.94,4.76 v24.77,7.94
SHIFT_DS
  Top 0.254: U$1.13 29.13,14.37 36.8,6.69 U6.14
SHIFT_OE
  Top 0.254: U6.13 36.15,6.71 29.29,13.57 U$1.12
SHIFT_SHCP
  Top 0.254: U$1.10 29.62,11.97 34.85,6.74 U6.11
SHIFT_STCP
  Top 0.254: U$1.11 29.46,12.77 35.5,6.72 U6.12
USB_D+
  Top 0.254: U$1.29 11.13,13.57 R2.1
USB_D-
  Top 0.254: U$1.30 13.19,12.77 R1.1
VBAT
  Top 0.508: U2.5 4.45,35.56 6.39,37.5 S1.P$3 3.07,39.48 1.59,38 1.59,29.53 JP3.1
VBUS  (via drill 0.5)
  Top 0.406: U1.8 7.92,32.73
  Top 0.508: U1.3 9.21,29.52 8.89,29.85 8.26,29.85 | 8.26,29.85 6.35,29.85 | 6.35,29.85 5.4,29.85 4.45,30.8 U2.1 3.28,31.72 C6.1 | 7.92,32.73 7.94,32.7 7.94,30.16 8.26,29.85 | 6.35,29.85 6.77,29.43 R3.2 6.35,26.89 6.35,24.45 6.67,24.13 9.53,24.13 11.05,22.61 11.05,22.56 C1.2 v11.11,20.32 11.11,19.69 10.49,19.06 JP1.VBUS | U$1.31 14.83,11.97 v14.29,11.43
  Bottom 0.508: v11.11,20.32 12.06,19.37 12.06,13.65 v14.29,11.43
VDD  (via drill 0.5)
  Top 0.254: U$1.32 18.1,11.17 | 18.1,11.17 19.63,11.17 19.92,10.88 U$1.4 19.92,8.97 20.96,7.94 C5.1 | 18.1,11.17 18.42,11.49 18.42,14.92 18.17,15.17 U$1.27 15.23,15.17 C2.1 12.41,16.43 R5.2 | C23.1 29.82,28.79 U$2.14 29.82,30.77 v29.85,30.8 | U$2.32 35.13,34.41 v34.61,34.92 | U$2.26 35.27,31.41 34.61,32.07 v34.61,32.7 | v29.53,33.97 29.46,33.91 U$2.6 25.89,33.91 C22.1 | C24.1 32.32,28.09 U$2.19 32.32,30.55 v32.07,30.8 | C12.1 22.52,25.96 R7.2 R6.2 R8.2 | U6.10 34.2,6.75 33.66,7.3 32.38,7.3 32.07,6.98 v32.07,6.03 | v40.56,6.03 38.29,6.03 U6.16
  Top 0.508: C2.1 13.97,17.15 v14.61,17.78 | C12.1 21.27,27.94 | 21.27,27.94 21.27,29.99 L1.P$2 18.1,30.48 15.21,27.59 U4.4 | v22.23,27.94 21.27,27.94 | v40.56,6.03 49.53,6.03 52.7,2.86 54.93,2.86 65.65,13.57 C7.1 65.65,21.03 62.94,23.74 U3.4
  Bottom 0.508: v32.07,30.8 v29.85,30.8 | v34.61,34.92 v34.61,32.7 32.7,30.8 v32.07,30.8 | 14.61,20.32 v22.23,27.94 25.72,31.43 25.72,37.15 26.35,37.78 26.99,37.78 29.53,35.24 | 14.61,20.32 13.97,20.32 12.7,21.59 4.13,21.59 1.91,19.37 1.91,2.86 2.7,2.06 | v14.61,17.78 14.61,20.32 | v40.56,6.03 v32.07,6.03 30.16,6.03 26.35,9.84 19.69,9.84 10.79,0.95 3.81,0.95 2.7,2.06 | J1.2 2.7,2.06 | v32.07,30.8 32.07,32.7 29.53,35.24 | v29.53,33.97 29.53,35.24

### Text on the board
tPlace: ON | microSDHC | GND | GND | ICSP | FTDI
bPlace: mattkeeter.com | 2.0 | MJK / 09/13